# EAGLE design V1 (EAGLE 9.5.1)
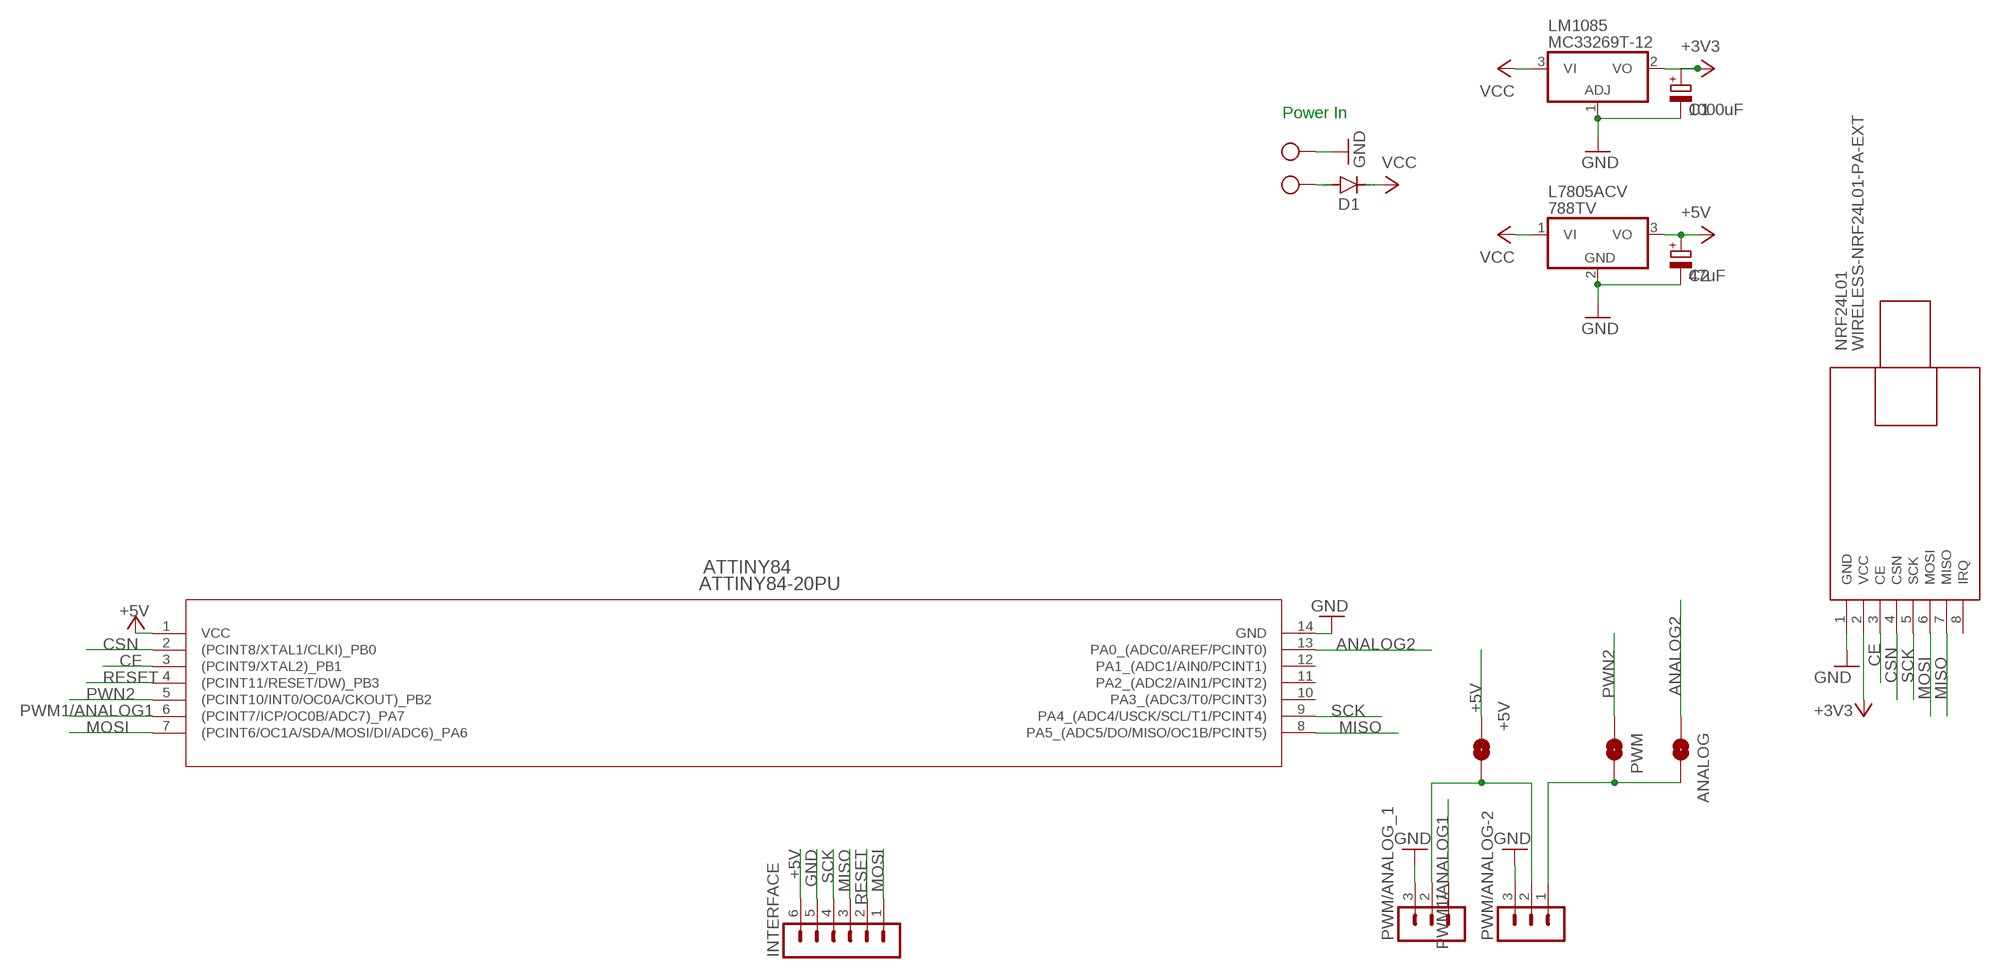
[diagram p0: schematic, sheet 1]

## Parts
+5V  JUMPER-SMT_2_NO_NO-SILK  [SMT-JUMPER_2_NO_NO-SILK]
ANALOG  JUMPER-SMT_2_NO_NO-SILK  [SMT-JUMPER_2_NO_NO-SILK]
ATTINY84  ATTINY84-20PU  [14P3]
C1  1000uF  CPOL-EUE2.5-6  [E2,5-6]
C2  47uF  CPOL-EUE2.5-6  [E2,5-6]
D1  1N5060GP  [DO15-12]
INTERFACE  MA06-1  [MA06-1]
L7805ACV  788TV  [TO220V]
LM1085  MC33269T-12  [TO220V]
NRF24L01  WIRELESS-NRF24L01-PA-EXT  [WIRELESS-NRF24L01-PA-EXT]
PWM  JUMPER-SMT_2_NO_NO-SILK  [SMT-JUMPER_2_NO_NO-SILK]
PWM/ANALOG-2  MA03-1  [MA03-1]
PWM/ANALOG_1  MA03-1  [MA03-1]
X1  MKDSN1,5/2-5,08  [MKDSN1,5/2-5,08]

## Nets
+3V3: C1.+ LM1085.2(VO) NRF24L01.2(VCC)
+5V: +5V.1 ATTINY84.1(VCC) C2.+ INTERFACE.6 L7805ACV.3(VO)
ANALOG2: ANALOG.1 ATTINY84.13(PA0_(ADC0/AREF/PCINT0))
CE: ATTINY84.3((PCINT9/XTAL2)_PB1) NRF24L01.3(CE)
CSN: ATTINY84.2((PCINT8/XTAL1/CLKI)_PB0) NRF24L01.4(CSN)
GND: ATTINY84.14(GND) C1.- C2.- INTERFACE.5 L7805ACV.2(GND) LM1085.1(ADJ) NRF24L01.1(GND) PWM/ANALOG-2.3 PWM/ANALOG_1.3 X1.2
MISO: ATTINY84.8(PA5_(ADC5/DO/MISO/OC1B/PCINT5)) INTERFACE.3 NRF24L01.7(MISO)
MOSI: ATTINY84.7((PCINT6/OC1A/SDA/MOSI/DI/ADC6)_PA6) INTERFACE.1 NRF24L01.6(MOSI)
N$1: +5V.2 PWM/ANALOG-2.2 PWM/ANALOG_1.2
N$2: ANALOG.2 PWM.2 PWM/ANALOG-2.1
N$7: D1.A X1.1
PWM1/ANALOG1: ATTINY84.6((PCINT7/ICP/OC0B/ADC7)_PA7) PWM/ANALOG_1.1
PWN2: ATTINY84.5((PCINT10/INT0/OC0A/CKOUT)_PB2) PWM.1
RESET: ATTINY84.4((PCINT11/RESET/DW)_PB3) INTERFACE.2
SCK: ATTINY84.9(PA4_(ADC4/USCK/SCL/T1/PCINT4)) INTERFACE.4 NRF24L01.5(SCK)
VCC: D1.C L7805ACV.1(VI) LM1085.3(VI)
Unconnected: ATTINY84.10(PA3_(ADC3/T0/PCINT3)) ATTINY84.11(PA2_(ADC2/AIN1/PCINT2)) ATTINY84.12(PA1_(ADC1/AIN0/PCINT1)) NRF24L01.8(IRQ)

## Notes on the sheet
- Power In

## Library data of the parts
+5V ANALOG PWM = SparkFun-Jumpers:JUMPER-SMT_2_NO: Normally open jumper This jumper has two pads in close proximity to each other. Apply solder to close the connection. Round pads are easier to solder for beginners, but are a lot larger. SparkFun Product that uses the round pads: SparkFun EL Sequencer <https://www.sparkfun.com/products/12781>
ATTINY84 = ATTINY84:ATTINY84-20PU; MANUFACTURER_PART_NUMBER: ATTINY8420PU; VENDOR: Atmel
C1 C2 = rcl:CPOL-EU: POLARIZED CAPACITOR, European symbol; SPICEPREFIX: C
D1 = diode:1N5060GP: DIODE controlled avalanche rectifier
INTERFACE = test:MA06-1: PIN HEADER; OC_FARNELL: unknown; OC_NEWARK: unknown
L7805ACV = linear:78*: Positive VOLTAGE REGULATOR Source: http://cache.national.com/ds/LM/LM78L05.pdf http://www.fairchildsemi.com/ds/LM/LM7805.pdf
LM1085 = linear:MC33269?*: Adjustable Output Low Dropout Voltage Regulator 800 mA Source: http://www.onsemi.com/pub/Collateral/MC33269-D.PDF
NRF24L01 = NEF24L01-Full:WIRELESS-NRF24L01-PA-EXT: 2.4 GHz Wireless Module based on NRF24L01 chip with preamplifier and external antenna Click here to find device on ebay.com <http://www.ebay.com/sch/nrf24l01+pa+lna+sma>
PWM/ANALOG-2 PWM/ANALOG_1 = con-lstb:MA03-1: PIN HEADER; OC_FARNELL: unknown; OC_NEWARK: unknown
X1 = con-phoenix-508:MKDSN1,5/2-5,08: MKDSN 1,5/ 2-5,08 Printklemme Nennstrom: 13,5 A Nennspannung: 250 V Rastermaß: 5,08 mm Polzahl: 2 Anschlussart: Schraubanschluss Montage: Löten Anschlussrichtung Leiter/Platine: 0 ° Artikelnummer: 1729128 Source: http://eshop.phoenixcontact.com .. 1729128.pdf

## Board
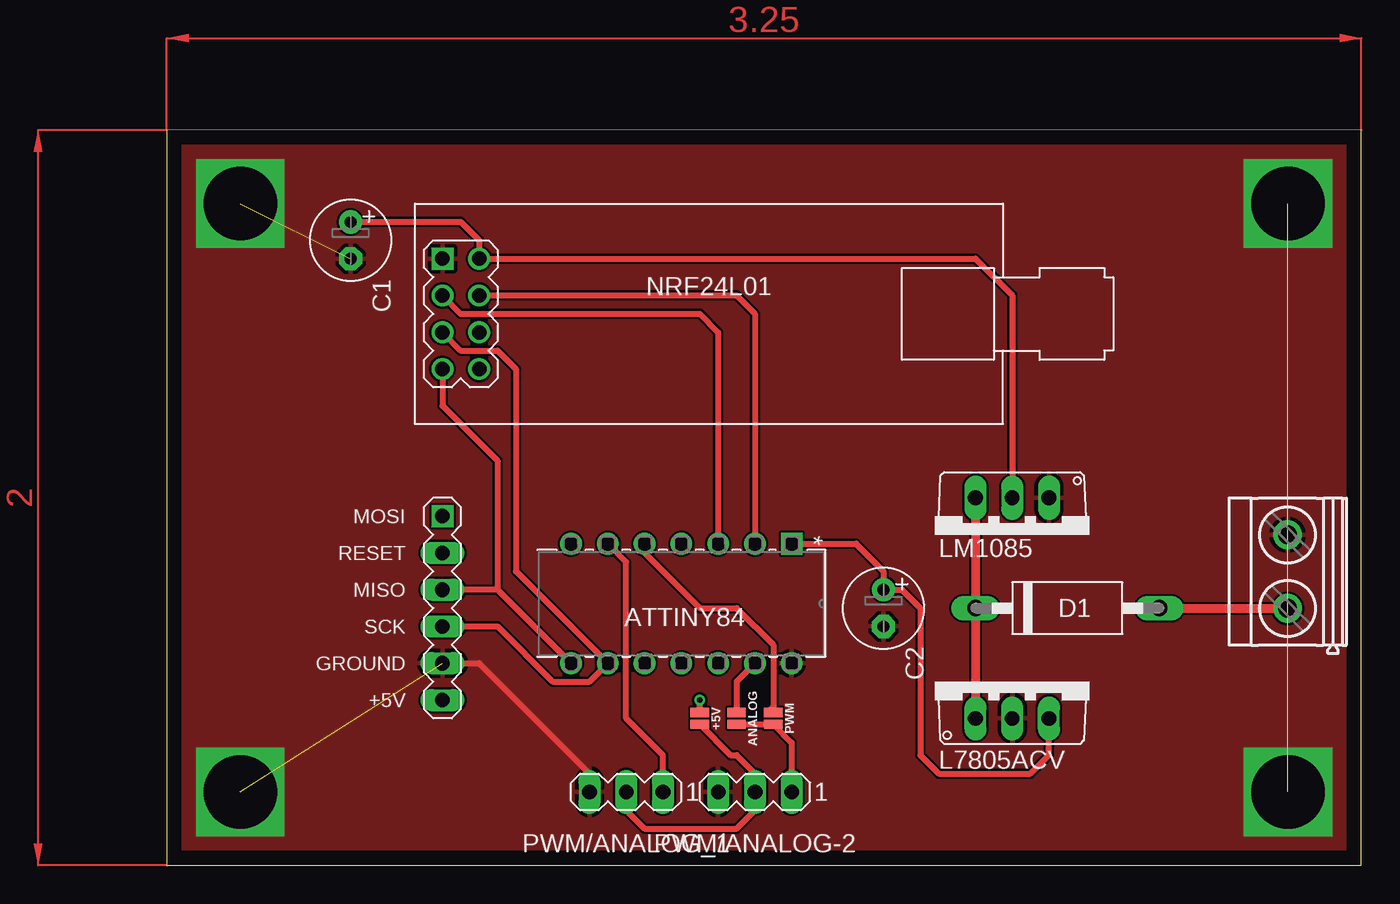
[diagram p1: board, top side]
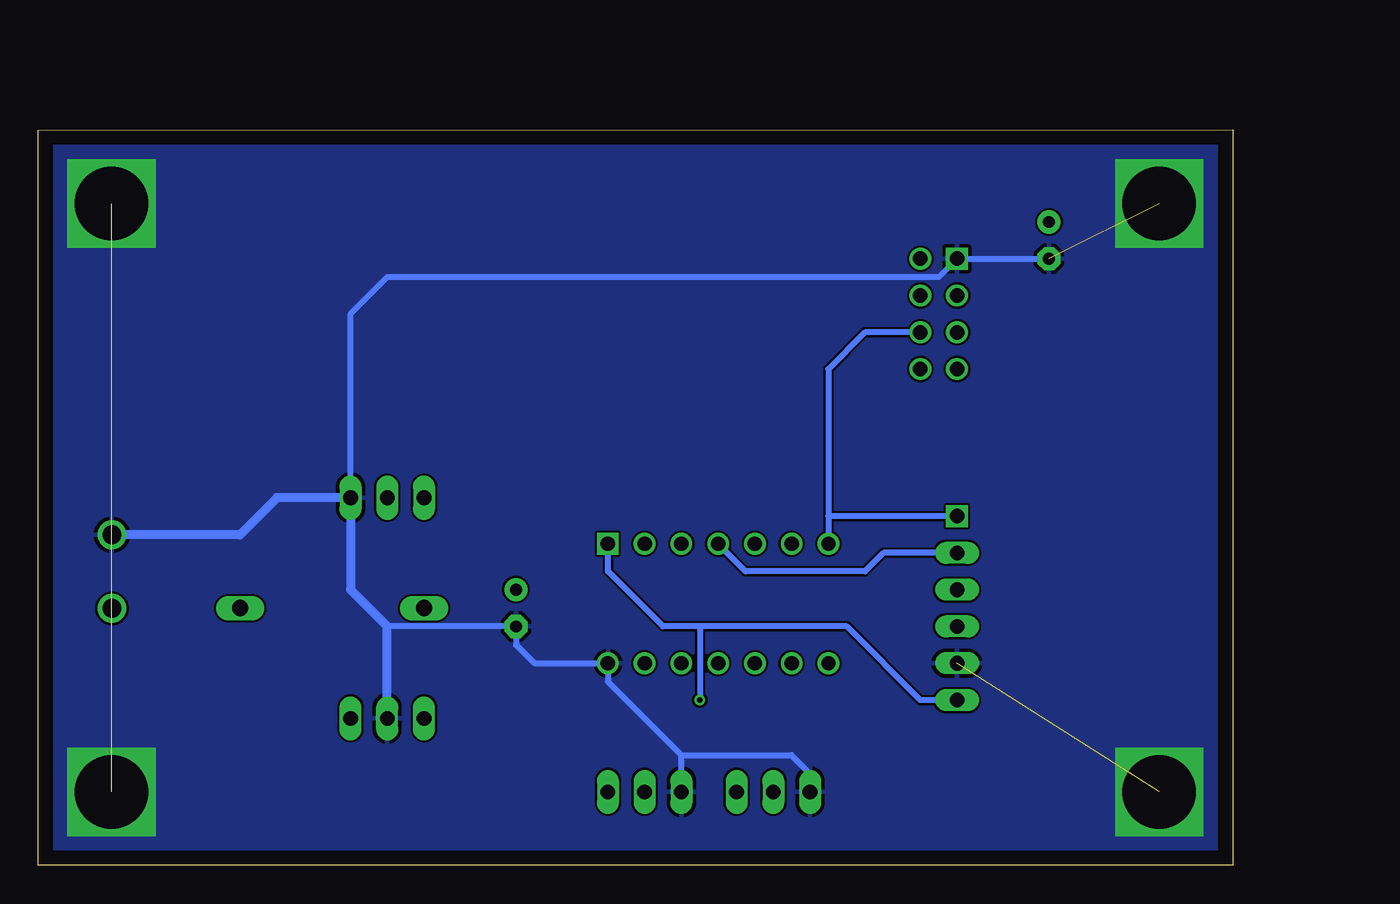
[diagram p2: board, bottom side, seen from below]

Size 82.55 x 50.81 mm. Coordinates in mm from the lower left corner, seen from the top.
Outline: 0,0 82.55,0 82.55,50.8 0,50.81 0,0
Copper layers (1*16): Top 0.035mm / dielectric 1.5mm / Bottom 0.035mm
Design rules "default": minimum track width 6mil, minimum drill 0.35mm, track to track 6mil, track to pad 6mil, pad to pad 6mil, via to via 6mil, smd to smd 6mil, copper to edge 40mil, drill to drill 6mil, minimum pad ring 10mil, minimum via ring 8mil, stop-mask expansion 4mil, vias tented up to drill 0mil, thermal gap 10mil

### Footprints (pad centres in the part's own frame; a part is rotated, then mirrored left to right if it is on the bottom)
SMT-JUMPER_2_NO_NO-SILK = smd 0.635 x 1.27: 1 -0.406,0; 2 0.406,0
14P3 = drill 0.991 pad 1.499 square: 1 -8.255,15.24 | drill 0.991 pad 1.499: 2 -8.255,12.7; 3 -8.255,10.16; 4 -8.255,7.62; 5 -8.255,5.08; 6 -8.255,2.54; 7 -8.255,0; 8 0,0; 9 0,2.54; 10 0,5.08; 11 0,7.62; 12 0,10.16; 13 0,12.7; 14 0,15.24
E2,5-6 = drill 0.813 pad 1.6: + -1.27,0 | drill 0.813 pad 1.6 octagon: - 1.27,0
DO15-12 = drill 1.118 long: A 6.35,0; C -6.35,0
MA06-1 = drill 1.016 square: 1 -6.35,0 | drill 1.016 long: 2 -3.81,0; 3 -1.27,0; 4 1.27,0; 5 3.81,0; 6 6.35,0
TO220V = drill 1.016 long: 1 -2.54,-2.54; 2 0,-2.54; 3 2.54,-2.54
WIRELESS-NRF24L01-PA-EXT = drill 1 square: 1 -18.415,3.81 | drill 1: 2 -15.875,3.81; 3 -18.415,1.27; 4 -15.875,1.27; 5 -18.415,-1.27; 6 -15.875,-1.27; 7 -18.415,-3.81; 8 -15.875,-3.81
MA03-1 = drill 1.016 long: 1 -2.54,0; 2 0,0; 3 2.54,0
MKDSN1,5/2-5,08 = drill 1.3 pad 2: 1 -2.561,0.025; 2 2.519,0.025

### Placement (x,y rotation side)
+5V  36.83,10.16 270 top
ANALOG  39.37,10.16 270 top
ATTINY84  27.94,13.97 270 top
C1  12.7,43.18 270 top
C2  49.53,17.78 270 top
D1  62.23,17.78 0 top
INTERFACE  19.05,17.78 270 top
L7805ACV  58.42,12.7 0 top
LM1085  58.42,22.86 180 top
NRF24L01  37.47,38.1 0 top
PWM  41.91,10.16 270 top
PWM/ANALOG-2  40.64,5.08 180 top
PWM/ANALOG_1  31.75,5.08 180 top
X1  77.47,20.32 90 top

### Tracks (layer width: path | path; a pad name or v marks a point on that pad's centre or on a via)
+3V3
  Top 0.406: C1.+ 20.32,44.45 21.59,43.18 NRF24L01.2 55.88,41.91 58.42,39.37 LM1085.2
+5V  (via drill 0.35)
  Top 0.406: L7805ACV.3 60.96,7.62 59.69,6.35 53.34,6.35 52.07,7.62 52.07,17.78 50.8,19.05 C2.+ 49.53,20.32 47.62,22.23 ATTINY84.1 | +5V.1 v36.83,11.43
  Bottom 0.406: ATTINY84.1 43.18,20.32 39.37,16.51 36.83,16.51 | 36.83,16.51 v36.83,11.43 | INTERFACE.6 21.59,11.43 26.67,16.51 36.83,16.51
ANALOG2
  Top 0.406: ATTINY84.13 39.37,12.7 ANALOG.1
CE
  Top 0.406: NRF24L01.3 20.32,38.1 36.83,38.1 38.1,36.83 ATTINY84.3
CSN
  Top 0.406: NRF24L01.4 39.37,39.37 40.64,38.1 ATTINY84.2
GND  (via drill 5.08)  (4 unrouted)
  Top 0.406: INTERFACE.5 21.59,13.97 29.21,6.35 PWM/ANALOG_1.3
  Bottom 0.406: C1.- NRF24L01.1 20.32,40.64 58.42,40.64 60.96,38.1 LM1085.1 | 58.42,16.51 C2.- 49.53,15.24 48.26,13.97 ATTINY84.14 43.18,12.7 38.1,7.62 | PWM/ANALOG-2.3 38.1,7.62 | 38.1,7.62 30.48,7.62 29.21,6.35 PWM/ANALOG_1.3
  Bottom 0.61: L7805ACV.2 58.42,16.51 60.96,19.05 LM1085.1 66.04,25.4 68.6,22.84 X1.2
  other vias: 5.08,45.72 5.08,5.08 77.47,5.08 77.47,45.72
  pour Top: 0,0 82.55,0 82.55,50.8 0,50.8
  pour Bottom: 0,50.8 0,0 82.55,0 82.55,50.8
MISO
  Top 0.406: ATTINY84.8 22.86,19.05 | 22.86,19.05 INTERFACE.3 | 22.86,19.05 22.86,27.94 19.05,31.75 NRF24L01.7
MOSI
  Bottom 0.406: NRF24L01.6 25.4,36.83 27.94,34.29 27.94,24.13 | 27.94,24.13 ATTINY84.7 | INTERFACE.1 27.94,24.13
N$1
  Top 0.406: +5V.2 38.96,7.62 39.37,7.62 40.64,6.35 PWM/ANALOG-2.2 40.64,3.81 39.37,2.54 33.02,2.54 31.75,3.81 PWM/ANALOG_1.2
N$2
  Top 0.406: ANALOG.2 PWM.2 43.18,8.48 PWM/ANALOG-2.1
N$7
  Top 0.61: D1.A 77.42,17.78 X1.1
PWM1/ANALOG1
  Top 0.406: PWM/ANALOG_1.1 34.29,7.62 31.75,10.16 31.75,20.95 ATTINY84.6
PWN2
  Top 0.406: ATTINY84.5 33.02,21.59 36.83,17.78 39.37,17.78 41.91,15.24 41.91,10.97 41.5,10.57 PWM.1
RESET
  Bottom 0.406: INTERFACE.2 24.13,21.59 25.4,20.32 33.66,20.32 ATTINY84.4
SCK  (via drill 0.35)
  Top 0.406: INTERFACE.4 22.86,16.51 26.67,12.7 29.21,12.7 ATTINY84.9 24.13,20.32 24.13,34.29 22.86,35.56 20.32,35.56 NRF24L01.5
  other vias: 30.48,13.97
VCC
  Top 0.61: LM1085.3 D1.C L7805ACV.1
(copper drawn outside any net)
  shapes: Top area x2

### Text on the board
tNames: MOSI | RESET | MISO | SCK | GROUND | +5V